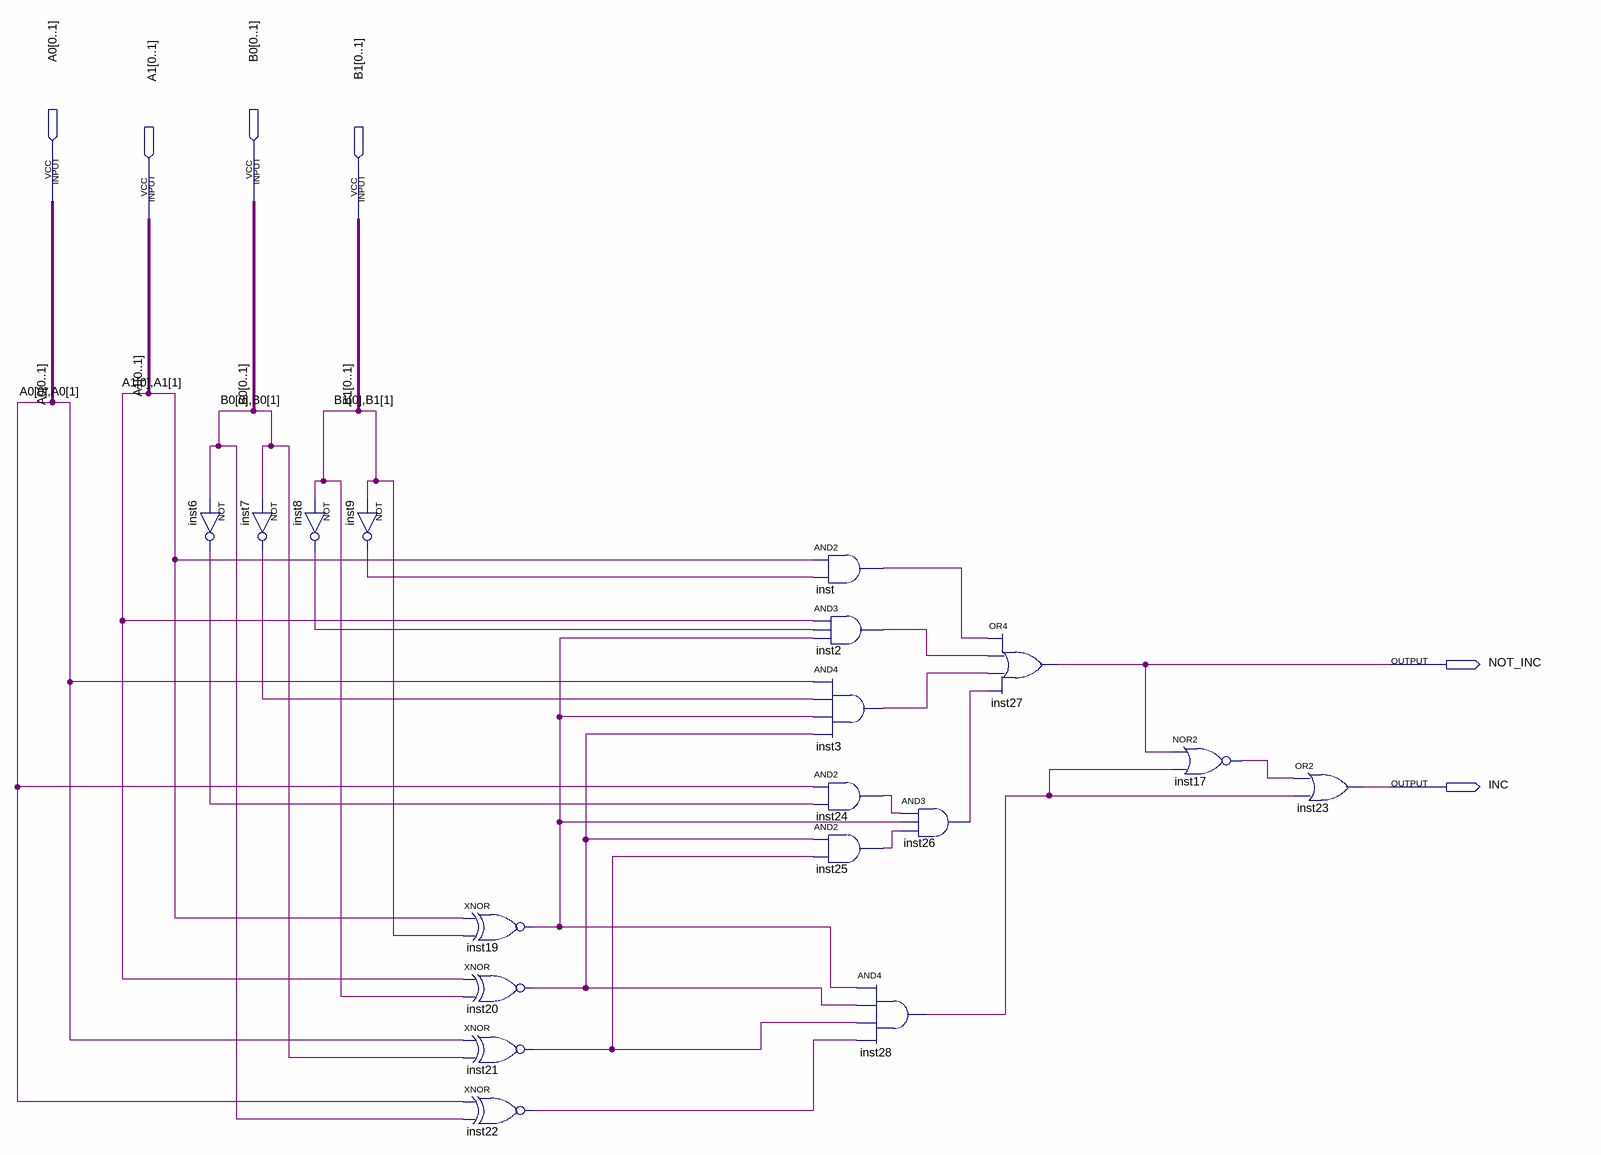
[diagram p0: schematic sheet]
// Quartus schematic StepB.bdf as structural Verilog: 18 symbols, 6 pins
module StepB (
  input  [0:1] A0,
  input  [0:1] B0,
  input  [0:1] A1,
  input  [0:1] B1,
  output NOT_INC,
  output INC
);

  wire inst2_out, inst3_out, inst6_out, inst7_out, inst8_out, inst9_out, inst17_out, inst19_out, inst20_out,
       inst21_out, inst22_out, inst24_out, inst25_out, inst26_out, inst28_out, inst_out;

  assign inst6_out = ~B0;  // NOT inst6, 2 bits wide
  assign inst7_out = ~B0;  // NOT inst7, 2 bits wide
  assign inst8_out = ~B1;  // NOT inst8, 2 bits wide
  assign inst9_out = ~B1;  // NOT inst9, 2 bits wide
  assign inst19_out = ~(A1 ^ B1);  // XNOR inst19, 2 bits wide
  assign inst20_out = ~(A1 ^ B1);  // XNOR inst20, 2 bits wide
  assign inst21_out = ~(A0 ^ B0);  // XNOR inst21, 2 bits wide
  assign inst22_out = ~(A0 ^ B0);  // XNOR inst22, 2 bits wide
  assign inst_out = A1 & {2{inst9_out}};  // AND2 inst, 2 bits wide
  assign inst2_out = A1 & {2{inst8_out}} & {2{inst19_out}};  // AND3 inst2, 2 bits wide
  assign inst3_out = A0 & {2{inst7_out}} & {2{inst19_out}} & {2{inst20_out}};  // AND4 inst3, 2 bits wide
  assign inst24_out = A0 & {2{inst6_out}};  // AND2 inst24, 2 bits wide
  and inst25 (inst25_out, inst20_out, inst21_out);
  and inst26 (inst26_out, inst24_out, inst19_out, inst25_out);
  and inst28 (inst28_out, inst19_out, inst20_out, inst21_out, inst22_out);
  or inst27 (NOT_INC, inst_out, inst2_out, inst3_out, inst26_out);
  nor inst17 (inst17_out, NOT_INC, inst28_out);
  or inst23 (INC, inst17_out, inst28_out);
endmodule
